# EasyEDA Pro project ProPrj_ax_driver_2025-11-09.epro, board 2-PCB_MT6816
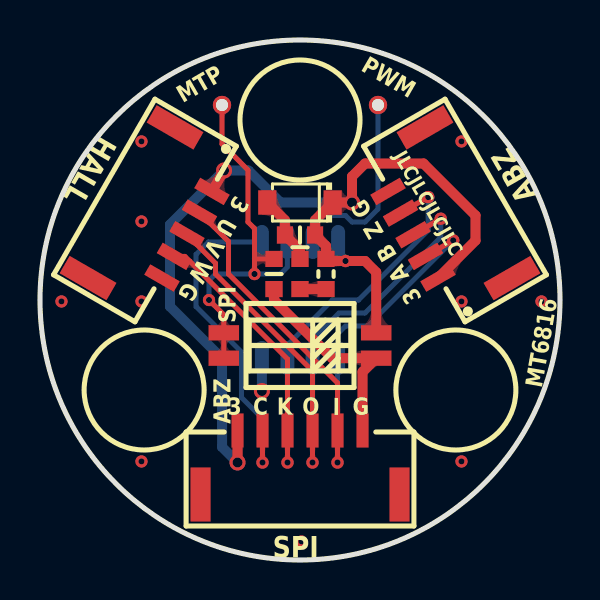
[diagram p4: board, top side]
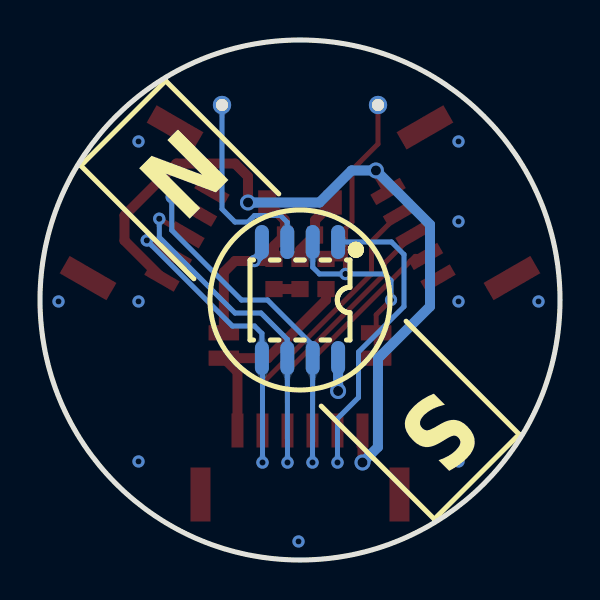
[diagram p5: board, bottom side, seen from below]

Outline 26 x 26 mm; copper layers: Top Layer, Bottom Layer. Coordinates in mm from the lower left corner of the outline.
Outline path: circle c13,13 r13
Stack: Top Layer 0.035mm / Dielectric1 1.51mm FR4 er 4.5 / Bottom Layer 0.035mm

## Design rules (mm)
spacing Default (default): track to track 0.152, other pairs 0 to 0.152
track width Default (default): min 0.152, default 0.152, max 25.4
differential pair differentialPair (default): width min 0.127, default 0.254, max 2.54; gap min 0.152, default 0.152
via Default (default): diameter min 0.508, default 0.508, max 100.025; hole min 0.305, default 0.305, max 59.995
net GND uses gge2154
pour e126 uses gge2148
pour e190 uses gge2154

## Placement (name value [footprint] x y rotation side)
C1  1u  [C0603_SMALL]  11.7 14.3 90 top
C5  100n  [C0603_SMALL]  13 16.25 180 top
D1  SMFJ5.0A  [SOD-123_L2.7-W1.6-LS3.7-RD]  13 17.88 180 top
LED1  LED-0603_B  [LED0603_BLUE_SMALL]  13 14.3 270 top
NOREF  -  [Pad_e308]  16.9 22.75 60 top
NOREF#2  -  [Pad_e323]  9.1 22.75 60 top
R4  1k  [R0603_SMALL]  14.3 14.3 270 top
SW1  DSHP02TSGET  [SW-SMD_4P_DSHP02TSGET]  13 10.72 90 top
U1  MT6816CT-ACD  [SOP-8_L5.0-W4.0-P1.27-LS6.2-BL]  13 13 0 bottom
U5  WAFER-GH1.25-5PWB  [CONN-SMD_5P-P1.25_X1251WRS-05HF-LPSW#2]  5.96 17.06 240 top
U6  WAFER-GH1.25-5PWB  [CONN-SMD_5P-P1.25_X1251WRS-05HF-LPSW]  20.04 17.06 120 top
U7  WAFER-GH1.25-6PWB  [CONN-SMD_6P-H-P1.25-L_X1251WRS-06HF-LPSW]  13 4.88 0 top

## Footprints (pads in the part's own frame, mm; a bottom-side part is the same pattern mirrored in y, then rotated)
C0603_SMALL
  rect 0.806x0.864 smd: 1(-0.753,0) 2(0.753,0)
CONN-SMD_5P-P1.25_X1251WRS-05HF-LPSW
  rect 0.6x1.7 smd: 1(-2.5,1.6) 2(-1.25,1.6) 3(0,1.6) 4(1.25,1.6) 5(2.5,1.6)
  rect 1x2.7 smd: 6(4.35,-1.6) 7(-4.35,-1.6)
CONN-SMD_5P-P1.25_X1251WRS-05HF-LPSW#2
  rect 0.6x1.7 smd: 1(-2.5,1.6) 2(-1.25,1.6) 3(0,1.6) 4(1.25,1.6) 5(2.5,1.6)
  rect 1x2.7 smd: 6(4.35,-1.6) 7(-4.35,-1.6)
CONN-SMD_6P-H-P1.25-L_X1251WRS-06HF-LPSW
  rect 0.6x1.7 smd: 1(-3.125,1.6) 2(-1.875,1.6) 3(-0.625,1.6) 4(0.625,1.6) 5(1.875,1.6) 6(3.125,1.6)
  rect 1x2.7 smd: 7(4.975,-1.6) 8(-4.975,-1.6)
LED0603_BLUE_SMALL
  rect 0.806x0.864 smd: 1(0.753,0) 2(-0.753,0)
Pad_e308
  round 0.914 hole 0.61: 1(0,0)
Pad_e323
  round 0.914 hole 0.61: 1(0,0)
R0603_SMALL
  rect 0.806x0.864 smd: 1(-0.753,0) 2(0.753,0)
SOD-123_L2.7-W1.6-LS3.7-RD
  rect 0.91x1.22 smd: 1(-1.635,0) 2(1.635,0)
SOP-8_L5.0-W4.0-P1.27-LS6.2-BL
  oval 0.7x1.7 smd: 1(-1.905,-2.9) 2(-0.635,-2.9) 3(0.635,-2.9) 4(1.905,-2.9) 5(1.905,2.9) 6(0.635,2.9) 7(-0.635,2.9) 8(-1.905,2.9)
SW-SMD_4P_DSHP02TSGET
  rect 0.762x1.524 smd: 1(-0.635,-3.81) 2(0.635,-3.81) 3(0.635,3.81) 4(-0.635,3.81)

## Nets
GND: C1.1 C5.2 D1.2 LED1.2 SW1.1 U1.8 U5.5 U5.6 U5.7 U6.5 U6.6 U6.7 U7.6 U7.7 U7.8
VCC: C5.1 D1.1 R4.1 SW1.2 U1.4 U5.1 U6.1 U7.1
A: U1.5 U5.2 U6.2 U7.5
B: U1.6 U5.3 U6.3 U7.4
CSN: U1.1 U7.2
HVPP: C1.2 NOREF#2.1 SW1.3 SW1.4 U1.2
PWM: NOREF.1 U1.3
R4_2: LED1.1 R4.2
Z: U1.7 U5.4 U6.4 U7.3

## Via types
v1: diameter 0.61, hole 0.305, Top Layer to Bottom Layer, 11 vias
v2: diameter 0.8, hole 0.5, Top Layer to Bottom Layer, 4 vias
v3: diameter 0.62, hole 0.31, Top Layer to Bottom Layer, 9 vias

## Routing (per net, layer and track width the routed paths; a pad name or vN(x,y) marks a point on that pad's centre or on a via; arc(x,y) is an arc through that point)
GND: length 15.9
  Top Layer w0.5: 13,15.05 13,15.5 12.25,16.25 12.25,16.99 11.36,17.87 ; 11.7,13.55 11.7,13 14.61,10.09 16.81,10.09 16.13,9.41 16.13,6.47
  Bottom Layer w0.5: U1.8 11.09,8.45
  vias: v1(1.07,12.93) v1(5.07,20.93) v1(5.07,16.93) v1(5.07,12.93) v1(5.07,4.93) v1(13.07,0.93) v1(21.07,20.93) v1(21.07,12.93) v1(21.07,4.93) v1(25.07,12.93) v2(11.09,8.45)
VCC: length 51
  Top Layer w0.5: 19.9,14.1 21.78,15.97 21.78,17.22 19.17,19.83 16.25,19.83 15.6,19.17 15.6,17.87 14.64,17.87 13.75,16.99 13.75,16.25 14.3,15.7 R4.1 14.4,14.95 v3(15.28,14.95) 16.25,14.95 16.81,14.39 SW1.2 ; U5.1 9.2,19.47 ; 9.88,6.47 9.88,4.87
  Bottom Layer w0.5: U1.4 14.91,15.32 v3(15.28,14.95) ; v2(9.2,19.48) 10.42,19.48 12.03,17.88 v2(15.6,17.88) ; 9.88,4.87 9.1,5.65 9.1,10.07 6.5,12.67 6.5,16.77 9.2,19.48
  vias: v2(9.88,4.88)
A: length 31.1
  Top Layer w0.25: U5.2 8,17.35 9.43,15.93 9.43,14.3 14.88,8.85 14.88,6.47 ; 14.87,6.47 14.87,4.87 ; 19.28,15.18 20.66,15.98
  Bottom Layer w0.25: 20.66,15.98 16.38,11.7 15.28,11.7 14.91,11.33 U1.5 14.87,10.07 14.87,4.87
  vias: v3(14.88,4.88) v3(20.66,15.98)
B: length 31.2
  Top Layer w0.25: 13.62,4.87 13.62,9.45 8.78,14.3 8.78,14.84 U5.3 ; 18.65,16.26 v3(20.04,17.06)
  Bottom Layer w0.25: v3(20.04,17.06) 20.04,16.14 16.25,12.35 14.95,12.35 13.63,11.03 U1.6 13.62,4.87
  vias: v3(13.62,4.88)
CSN: length 16.9
  Top Layer w0.25: 11.13,6.47 11.13,4.87
  Bottom Layer w0.25: U1.1 8.43,15.9 7.8,15.28 7.8,12.67 10.07,10.4 10.07,8.13 11.13,7.07 11.13,4.87
  vias: v3(11.12,4.88)
HVPP: length 19.7
  Top Layer w0.25: 9.19,10.09 SW1.3 9.19,12.26 8.45,13 ; 10.72,15.05 C1.2 ; 10.72,15.05 10.72,16.58 10.4,16.9 10.4,19.5 9.1,20.8 9.1,22.75 ; 10.72,15.05 v3(10.72,14.3)
  Bottom Layer w0.25: 8.45,13 8.45,13.98 8.78,14.3 v3(10.72,14.3) 12.02,14.3 12.37,14.64 U1.2
  vias: v1(8.45,13)
PWM: length 10
  Bottom Layer w0.25: 16.9,22.75 16.9,17.55 16.25,16.9 15.6,16.9 15.28,17.22 13.98,17.22 13.63,16.89 U1.3
R4_2: length 1.3
  Top Layer w0.5: LED1.1 R4.2
Z: length 31.5
  Top Layer w0.25: 12.38,4.87 12.38,10.05 7.24,15.18 U5.4 ; U6.4 v3(19.41,18.15)
  Bottom Layer w0.25: v3(19.41,18.15) 19.41,16.49 15.93,13 14.63,13 12.37,10.74 U1.7 12.38,4.87
  vias: v3(12.38,4.88)

## Copper pours and planes (outline as drawn; the poured copper is in the pictures)
GND on Top Layer: -2,28 -2,-2 27.2,-2 27.2,28
GND on Bottom Layer: -2,28 28,28 28,-2 -2,-2

Small or netless copper shapes (teardrops, artwork), in the pictures only: 51 on Top Layer, 27 on Bottom Layer

## Text on the board
Bottom Silkscreen Layer: S | N
Top Silkscreen Layer: JLCJLCJLCJLC | 3 | C | K | O | I | G | MTP | MT6816 | ABZ | SPI | Z | B | A | W | V | U | PWM | HALL
